# EAGLE schematic untitled (EAGLE 7.3.0)
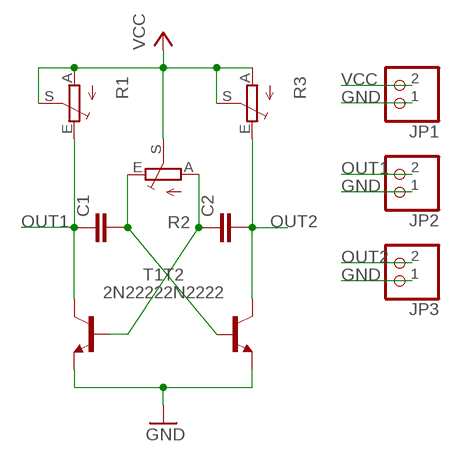
[diagram p0: schematic, sheet 1]

## Parts
C1  C-EU025-025X050  [C025-025X050]
C2  C-EU025-025X050  [C025-025X050]
JP1  PINHD-1X2  [1X02]
JP2  PINHD-1X2  [1X02]
JP3  PINHD-1X2  [1X02]
R1  TRIM_EU-CA9V  [CA9V]
R2  TRIM_EU-CA9V  [CA9V]
R3  TRIM_EU-CA9V  [CA9V]
T1  2N2222  [TO18]
T2  2N2222  [TO18]

## Nets
GND: JP1.1 JP2.1 JP3.1 T1.1(E) T2.1(E)
N$3: C1.2 R2.E T2.2(B)
N$4: C2.1 R2.A T1.2(B)
OUT1: C1.1 JP2.2 R1.E T1.3(C)
OUT2: C2.2 JP3.2 R3.E T2.3(C)
VCC: JP1.2 R1.A R1.S R2.S R3.A R3.S

## Library data of the parts
C1 C2 = rcl:C-EU: CAPACITOR, European symbol
JP1-JP3 = pinhead:PINHD-1X2: PIN HEADER
R1-R3 = pot:TRIM_EU-: POTENTIOMETER
T1 T2 = transistor-neu-to92:2N2222: NPN TRANSISTOR